# EAGLE design NSA_Control_FinalPTH3 (EAGLE 6.1)
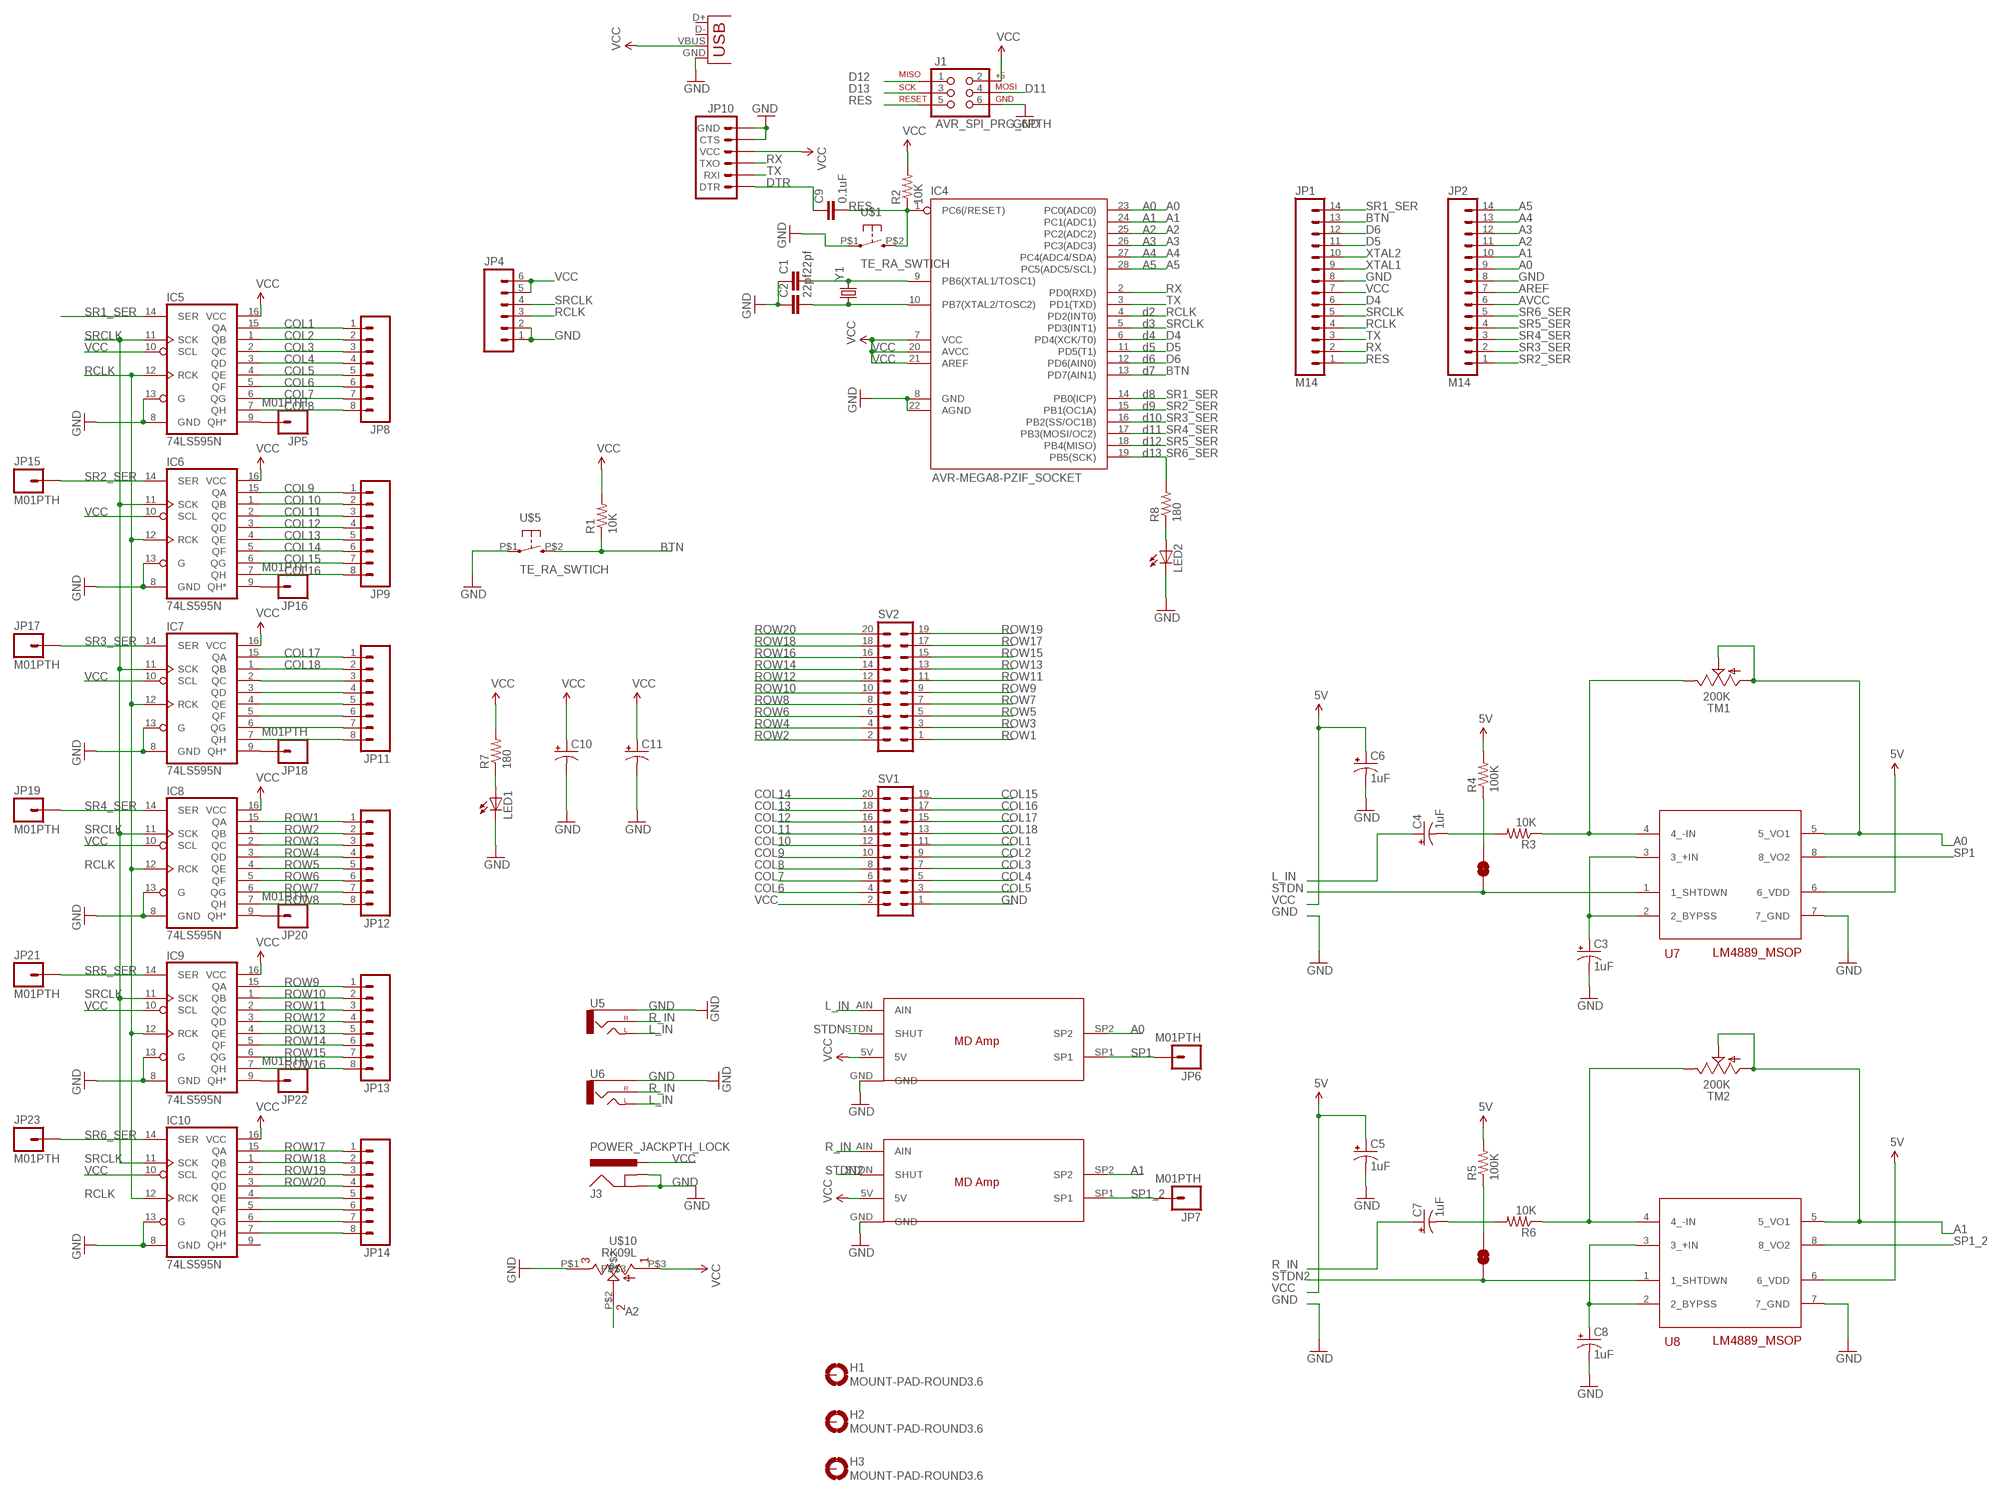
[diagram p0: schematic, sheet 1]

## Parts
C1  22pf  CAPPTH  [CAP-PTH-SMALL]
C2  22pf  CAPPTH  [CAP-PTH-SMALL]
C3  1uF  CAP_POL1206-KIT  [EIA3216-KIT]
C4  1uF  CAP_POL1206-KIT  [EIA3216-KIT]
C5  1uF  CAP_POL1206-KIT  [EIA3216-KIT]
C6  1uF  CAP_POL1206-KIT  [EIA3216-KIT]
C7  1uF  CAP_POL1206-KIT  [EIA3216-KIT]
C8  1uF  CAP_POL1206-KIT  [EIA3216-KIT]
C9  0.1uF  CAPPTH  [CAP-PTH-SMALL]
C10  CPOL-USE5-8.5  [E5-8,5]
C11  CPOL-USE5-8.5  [E5-8,5]
H1  MOUNT-PAD-ROUND3.6  [3,6-PAD]
H2  MOUNT-PAD-ROUND3.6  [3,6-PAD]
H3  MOUNT-PAD-ROUND3.6  [3,6-PAD]
IC4  AVR-MEGA8-PZIF_SOCKET  [DIL28-3-ZIF_SOCKET]
IC5  74LS595N  [DIL16]
IC6  74LS595N  [DIL16]
IC7  74LS595N  [DIL16]
IC8  74LS595N  [DIL16]
IC9  74LS595N  [DIL16]
IC10  74LS595N  [DIL16]
J1  AVR_SPI_PRG_6PTH  [2X3]
J3  POWER_JACKPTH_LOCK  [POWER_JACK_PTH_LOCK]
JP1  M14  [1X14]
JP2  M14  [1X14]
JP4  M06LONGPADS  [1X06_LONGPADS]
JP5  M01PTH  [1X01]
JP6  M01PTH  [1X01]
JP7  M01PTH  [1X01]
JP8  M08LONGPADS  [1X08_LONGPADS]
JP9  M08LONGPADS  [1X08_LONGPADS]
JP10  ARDUINO_SERIAL_PROGRAMLOCK  [1X06_LOCK]
JP11  M08LONGPADS  [1X08_LONGPADS]
JP12  M08LONGPADS  [1X08_LONGPADS]
JP13  M08LONGPADS  [1X08_LONGPADS]
JP14  M08LONGPADS  [1X08_LONGPADS]
JP15  M01PTH  [1X01]
JP16  M01PTH  [1X01]
JP17  M01PTH  [1X01]
JP18  M01PTH  [1X01]
JP19  M01PTH  [1X01]
JP20  M01PTH  [1X01]
JP21  M01PTH  [1X01]
JP22  M01PTH  [1X01]
JP23  M01PTH  [1X01]
LED1  LED5MM  [LED5MM]
LED2  LED5MM  [LED5MM]
R1  10K  RESISTORPTH-1/4W  [AXIAL-0.4]
R2  10K  RESISTORPTH-1/4W  [AXIAL-0.4]
R3  10K  RESISTOR1206  [1206]
R4  100K  RESISTOR1206  [1206]
R5  100K  RESISTOR1206  [1206]
R6  10K  RESISTOR1206  [1206]
R7  180  RESISTORPTH-1/4W  [AXIAL-0.4]
R8  180  RESISTORPTH-1/4W  [AXIAL-0.4]
SJ1  SOLDERJUMPERNC  [SJ_2S]
SJ2  SOLDERJUMPERNC  [SJ_2S]
SV1  ML20  [ML20]
SV2  ML20  [ML20]
TM1  200K  TRIM  [6MM]
TM2  200K  TRIM  [6MM]
U5  AUDIO-JACKPTH  [AUDIO-JACK]
U6  AUDIO-JACKPTH  [AUDIO-JACK]
U7  LM4889_MSOP  [MSOP8]
U8  LM4889_MSOP  [MSOP8]
U$1  TE_RA_SWTICH  [TE_RA_SWITCH]
U$5  TE_RA_SWTICH  [TE_RA_SWITCH]
U$6  MD_AMP  [MD_AMP]
U$7  MD_AMP  [MD_AMP]
U$10  RK09L  [RK09L]
X1  USBSMD  [USB-MINIB]
Y1  CRYSTALHC49UV  [HC49U-V]

## Nets
6V: R4.2 R5.2 U7.6(6_VDD) U8.6(6_VDD) ; supply symbol labelled 5V
A0: IC4.23(PC0(ADC0)) JP2.9 TM1.A TM1.S U7.5(5_VO1) U$6.SP2
A1: IC4.24(PC1(ADC1)) JP2.10 TM2.A TM2.S U8.5(5_VO1) U$7.SP2
A2: IC4.25(PC2(ADC2)) JP2.11 U$10.P$2
A3: IC4.26(PC3(ADC3)) JP2.12
A4: IC4.27(PC4(ADC4/SDA)) JP2.13
A5: IC4.28(PC5(ADC5/SCL)) JP2.14
AREF: JP2.7
AVCC: JP2.6
BTN: IC4.13(PD7(AIN1)) JP1.13 R1.P$1 U$5.P$2
COL1: IC5.15(QA) JP8.1 SV1.11
COL2: IC5.1(QB) JP8.2 SV1.9
COL3: IC5.2(QC) JP8.3 SV1.7
COL4: IC5.3(QD) JP8.4 SV1.5
COL5: IC5.4(QE) JP8.5 SV1.3
COL6: IC5.5(QF) JP8.6 SV1.4
COL7: IC5.6(QG) JP8.7 SV1.6
COL8: IC5.7(QH) JP8.8 SV1.8
COL9: IC6.15(QA) JP9.1 SV1.10
COL10: IC6.1(QB) JP9.2 SV1.12
COL11: IC6.2(QC) JP9.3 SV1.14
COL12: IC6.3(QD) JP9.4 SV1.16
COL13: IC6.4(QE) JP9.5 SV1.18
COL14: IC6.5(QF) JP9.6 SV1.20
COL15: IC6.6(QG) JP9.7 SV1.19
COL16: IC6.7(QH) JP9.8 SV1.17
COL17: IC7.15(QA) JP11.1 SV1.15
COL18: IC7.1(QB) JP11.2 SV1.13
D4: IC4.6(PD4(XCK/T0)) JP1.6
D5: IC4.11(PD5(T1)) JP1.11
D6: IC4.12(PD6(AIN0)) JP1.12
D11: J1.4
D12: J1.1
D13: J1.3
DTR: C9.1 JP10.1(DTR)
GND: C1.1 C2.1 C3.C(-) C5.C(-) C6.C(-) C8.C(-) C10.- C11.- IC4.8(GND) IC4.22(AGND) IC5.8(GND) IC5.13(G) IC6.8(GND) IC6.13(G) IC7.8(GND) IC7.13(G) IC8.8(GND) IC8.13(G) IC9.8(GND) IC9.13(G) IC10.8(GND) IC10.13(G) J1.6 J3.GND J3.GNDBREAK JP1.8 JP2.8 JP4.1 JP4.2 JP10.5(CTS) JP10.6(GND) LED1.K(C) LED2.K(C) SV1.1 U5.SLEEVE U6.SLEEVE U7.7(7_GND) U8.7(7_GND) U$1.P$1 U$5.P$1 U$6.GND U$7.GND U$10.P$1 X1.GND
L_IN: C4.A(+) U5.TIP(LEFT) U6.TIP(LEFT) U$6.AIN
N$1: IC7.4(QE) JP11.5
N$2: IC7.5(QF) JP11.6
N$3: IC7.6(QG) JP11.7
N$4: IC7.7(QH) JP11.8
N$5: IC10.4(QE) JP14.5
N$6: IC10.5(QF) JP14.6
N$7: LED1.A R7.P$1
N$8: LED2.A R8.P$1
N$9: IC10.6(QG) JP14.7
N$10: C8.A(+) U8.2(2_BYPSS) U8.3(3_+IN)
N$11: IC5.9(QH*) JP5.1
N$12: IC6.9(QH*) JP16.1
N$13: IC10.7(QH) JP14.8
N$14: C3.A(+) U7.2(2_BYPSS) U7.3(3_+IN)
N$15: R6.1 TM2.E U8.4(4_-IN)
N$16: R3.1 TM1.E U7.4(4_-IN)
N$17: C4.C(-) R3.2
N$18: C7.C(-) R6.2
N$19: R4.1 SJ1.2
N$20: R5.1 SJ2.2
N$21: IC7.2(QC) JP11.3
N$22: IC7.3(QD) JP11.4
N$23: IC7.9(QH*) JP18.1
N$24: IC8.9(QH*) JP20.1
N$25: IC9.9(QH*) JP22.1
R_IN: C7.A(+) U5.RING(RIGHT) U6.RING(RIGHT) U$7.AIN
RCLK: IC4.4(PD2(INT0)) IC5.12(RCK) IC6.12(RCK) IC7.12(RCK) IC8.12(RCK) IC9.12(RCK) IC10.12(RCK) JP1.4 JP4.3
RES: C9.2 IC4.1(PC6(/RESET)) J1.5 JP1.1 R2.P$1 U$1.P$2
ROW1: IC8.15(QA) JP12.1 SV2.1
ROW2: IC8.1(QB) JP12.2 SV2.2
ROW3: IC8.2(QC) JP12.3 SV2.3
ROW4: IC8.3(QD) JP12.4 SV2.4
ROW5: IC8.4(QE) JP12.5 SV2.5
ROW6: IC8.5(QF) JP12.6 SV2.6
ROW7: IC8.6(QG) JP12.7 SV2.7
ROW8: IC8.7(QH) JP12.8 SV2.8
ROW9: IC9.15(QA) JP13.1 SV2.9
ROW10: IC9.1(QB) JP13.2 SV2.10
ROW11: IC9.2(QC) JP13.3 SV2.11
ROW12: IC9.3(QD) JP13.4 SV2.12
ROW13: IC9.4(QE) JP13.5 SV2.13
ROW14: IC9.5(QF) JP13.6 SV2.14
ROW15: IC9.6(QG) JP13.7 SV2.15
ROW16: IC9.7(QH) JP13.8 SV2.16
ROW17: IC10.15(QA) JP14.1 SV2.17
ROW18: IC10.1(QB) JP14.2 SV2.18
ROW19: IC10.2(QC) JP14.3 SV2.19
ROW20: IC10.3(QD) JP14.4 SV2.20
RX: IC4.2(PD0(RXD)) JP1.2 JP10.3(TXO)
SP1: JP6.1 U7.8(8_VO2) U$6.SP1
SP1_2: JP7.1 U8.8(8_VO2) U$7.SP1
SR1_SER: IC4.14(PB0(ICP)) IC5.14(SER) JP1.14
SR2_SER: IC4.15(PB1(OC1A)) IC6.14(SER) JP2.1 JP15.1
SR3_SER: IC4.16(PB2(SS/OC1B)) IC7.14(SER) JP2.2 JP17.1
SR4_SER: IC4.17(PB3(MOSI/OC2)) IC8.14(SER) JP2.3 JP19.1
SR5_SER: IC4.18(PB4(MISO)) IC9.14(SER) JP2.4 JP21.1
SR6_SER: IC4.19(PB5(SCK)) IC10.14(SER) JP2.5 JP23.1 R8.P$2
SRCLK: IC4.5(PD3(INT1)) IC5.11(SCK) IC6.11(SCK) IC7.11(SCK) IC8.11(SCK) IC9.11(SCK) IC10.11(SCK) JP1.5 JP4.4
STDN: SJ1.1 U7.1(1_SHTDWN) U$6.STDN(SHUT)
STDN2: SJ2.1 U8.1(1_SHTDWN) U$7.STDN(SHUT)
TX: IC4.3(PD1(TXD)) JP1.3 JP10.2(RXI)
VCC: C5.A(+) C6.A(+) C10.+ C11.+ IC4.7(VCC) IC4.20(AVCC) IC4.21(AREF) IC5.10(SCL) IC5.16(VCC) IC6.10(SCL) IC6.16(VCC) IC7.10(SCL) IC7.16(VCC) IC8.10(SCL) IC8.16(VCC) IC9.10(SCL) IC9.16(VCC) IC10.10(SCL) IC10.16(VCC) J1.2 J3.PWR JP1.7 JP4.5 JP4.6 JP10.4(VCC) R1.P$2 R2.P$2 R7.P$2 SV1.2 U$6.5V U$7.5V U$10.P$3 X1.VBUS ; supply symbol labelled 5V
XTAL1: C1.2 IC4.9(PB6(XTAL1/TOSC1)) JP1.9 Y1.2
XTAL2: C2.2 IC4.10(PB7(XTAL2/TOSC2)) JP1.10 Y1.1
Unconnected: H1.B3,6(MOUNT) H2.B3,6(MOUNT) H3.B3,6(MOUNT) IC10.9(QH*) X1.D+ X1.D-

## Notes on the sheet
- A0
- A1
- A2
- A3
- A4
- A5
- d2
- d3
- d4
- d5
- d6
- d7
- d8
- d9
- d10
- d11
- d12
- d13

## Library data of the parts
C1 C2 C9 = sparkFun:CAP: Capacitor Standard 0603 ceramic capacitor, and 0.1" leaded capacitor.
C3-C8 = sparkFun:CAP_POL: Capacitor Polarized These are standard SMD and PTH capacitors. Normally 10uF, 47uF, and 100uF in electrolytic and tantalum varieties. Always verify the external diameter of the through hole cap, it varies with capacity, voltage, and manufacturer. The EIA devices should be standard.
C10 C11 = adafruit:CPOL-US: POLARIZED CAPACITOR, American symbol
H1-H3 = holes:MOUNT-PAD-ROUND: MOUNTING PAD, round
IC4 = sparkFun:AVR-MEGA8-P: MICROCONTROLLER 8 Kbytes FLASH 1 kbytes SRAM 512 bytes EEPROM USART 4-channel 10 bit ADC 2-channel 8 bit ADC
IC5-IC10 = sparkFun:74*595: 8-bit SHIFT REGISTER, output latch
J1 = sparkFun:AVR_SPI_PRG_6: AVR ISP 6 Pin This is the reduced ISP connector for AVR programming. Common on Arduino. This footprint will take up less PCB space and can be used with a 10-pin to 6-pin adapter such as SKU: BOB-08508
J3 = sparkFun:POWER_JACK: Power Jack This is the standard 5.5mm barrel jack for power. The PTH is the most common, proven, reliable, footprint. All others are experimental. The Slot footprint only works if the mill layer is transmitted to the PCB fab house so be warned. Spark Fun Electronics SKU : PRT-00119. Mating wall wart : TOL-00298 (and others)
JP1 JP2 = sparkFun:M14: Header 14 Standard 14-pin 0.1" header. Use with straight break away headers (SKU : PRT-00116), right angle break away headers (PRT-00553), swiss pins (PRT-00743), machine pins (PRT-00117), and female headers (PRT-00115).
JP4 = sparkFun:M06: Header 6 Standard 6-pin 0.1" header. Use with straight break away headers (SKU : PRT-00116), right angle break away headers (PRT-00553), swiss pins (PRT-00743), machine pins (PRT-00117), and female headers (PRT-00115). Molex polarized connector foot print use with SKU : PRT-08094 with associated crimp pins and housings. NOTES ON THE VARIANTS LOCK and LOCK_LONGPADS... This footprint was designed to help hold the alignment of a through-hole component (i.e. 6-pin header) while soldering it into place. You may notice that each hole has been shifted either up or down by 0.005 of an inch from it's more standard position (which is a perfectly straight line). This slight alteration caused the pins (the squares in the middle) to touch the edges of the holes. Because they are alternating, it causes a "brace" to hold the component in place. 0.005 has proven to be the perfect amount of "off-center" position when using our standard breakaway headers. Although looks a little odd when you look at the bare footprint, once you have a header in there, the alteration is very hard to notice. Also, if you push a header all the way into place, it is covered up entirely on the bottom side. This idea of altering the position of holes to aid alignment will be further integrated into the Sparkfun Library for other footprints. It can help hold any component with 3 or more connection pins.
JP5-JP7 JP15-JP23 = sparkFun:M01: Header 1 Standard 1-pin 0.1" header. Use with straight break away headers (SKU : PRT-00116), right angle break away headers (PRT-00553), swiss pins (PRT-00743), machine pins (PRT-00117), and female headers (PRT-00115).
JP8 JP9 JP11-JP14 = sparkFun:M08: Header 8 Standard 8-pin 0.1" header. Use with straight break away headers (SKU : PRT-00116), right angle break away headers (PRT-00553), swiss pins (PRT-00743), machine pins (PRT-00117), and female headers (PRT-00115).
JP10 = sparkFun:ARDUINO_SERIAL_PROGRAM
LED1 LED2 = sparkFun:LED: LEDs Standard schematic elements and footprints for 5mm, 3mm, 1206, and 0603 sized LEDs. 5mm - Spark Fun Electronics SKU : COM-00529 (and others)
R1-R8 = sparkFun:RESISTOR: Resistor Basic schematic elements and footprints for 0603, 1206, and PTH resistors.
SJ1 SJ2 = ModernDevice:SOLDERJUMPER: Solder Jumper Standard SMD solder jumper. Used to automate production. Two varients : Normally Open and Normally Closed are the same, but have different paste layers. NC will have a large amount of paste and should jumper during reflow.
SV1 SV2 = con-harting-ml:ML20: HARTING; OC_FARNELL: unknown; OC_NEWARK: unknown
TM1 TM2 = adafruit:TRIM
U5 U6 = sparkFun:AUDIO-JACK: 3.5mm Audio Jack Simple 3.5mm common PCB mount audio jack. SKU: PRT-08032
U7 U8 = ModernDevice:LM4889: LM4889 1 W Audio Amp
U$1 U$5 = 001_BoltCustom:TE_RA_SWTICH
U$6 U$7 = 001_BoltCustom:MD_AMP
U$10 = 001_BoltCustom:RK09L
X1 = sparkFun:USB: USB Connectors USB-B-PTH is fully proven SKU : PRT-00139 USB-miniB is fully proven SKU : PRT-00587 USB-A-PCB is untested. USB-A-H is throughly reviewed, but untested. Spark Fun Electronics SKU : PRT-00437 USB-B-SMT is throughly reviewed, but untested. Needs silkscreen touching up. USB-A-S has not been used/tested USB-MB-H has not been used/tested
Y1 = sparkFun:CRYSTAL: Crystals Various standard crystals. Proven footprints. Spark Fun Electronics SKU : COM-00534

## Board
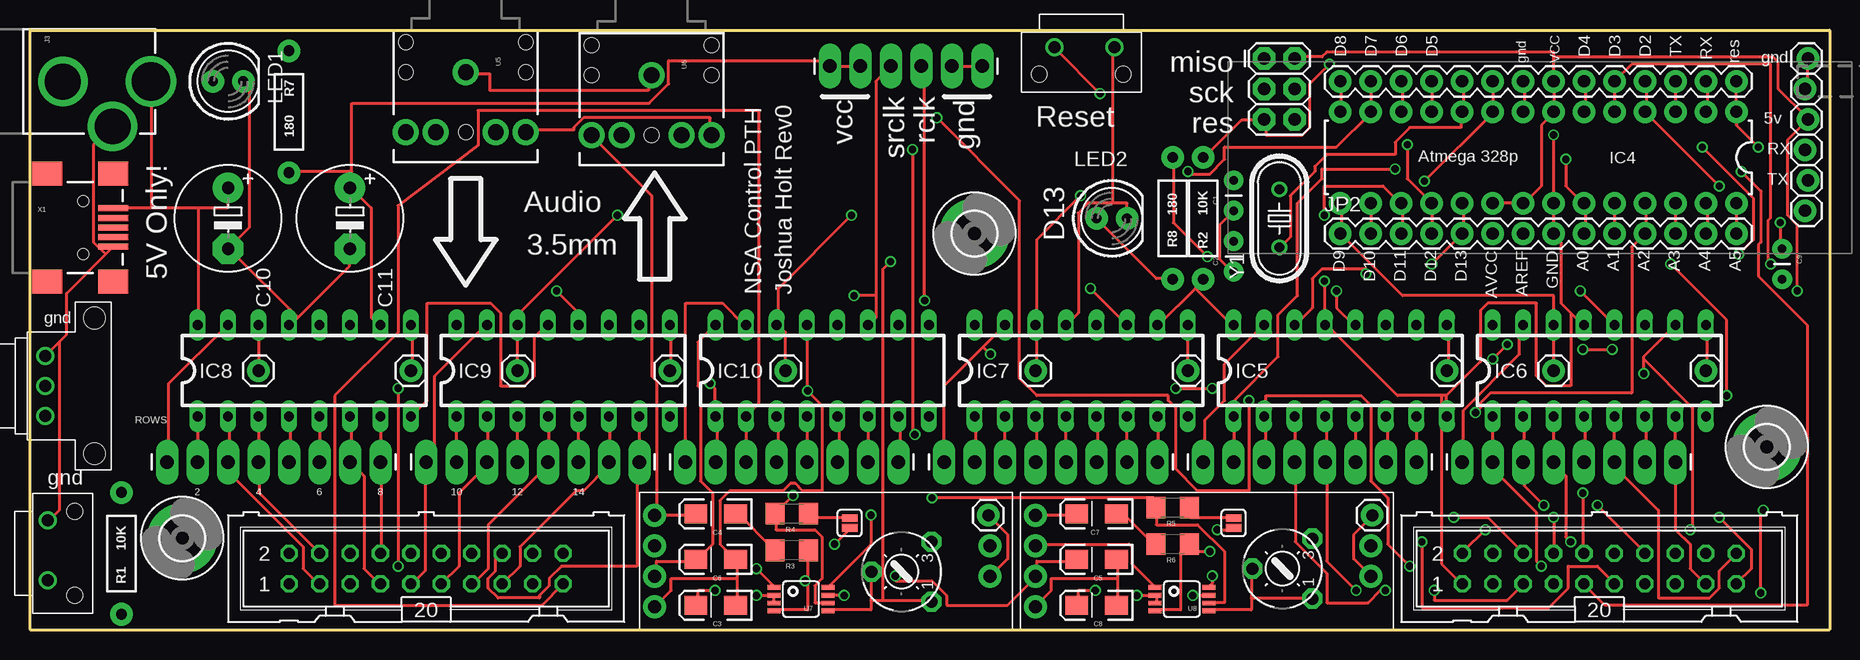
[diagram p1: board, top side]
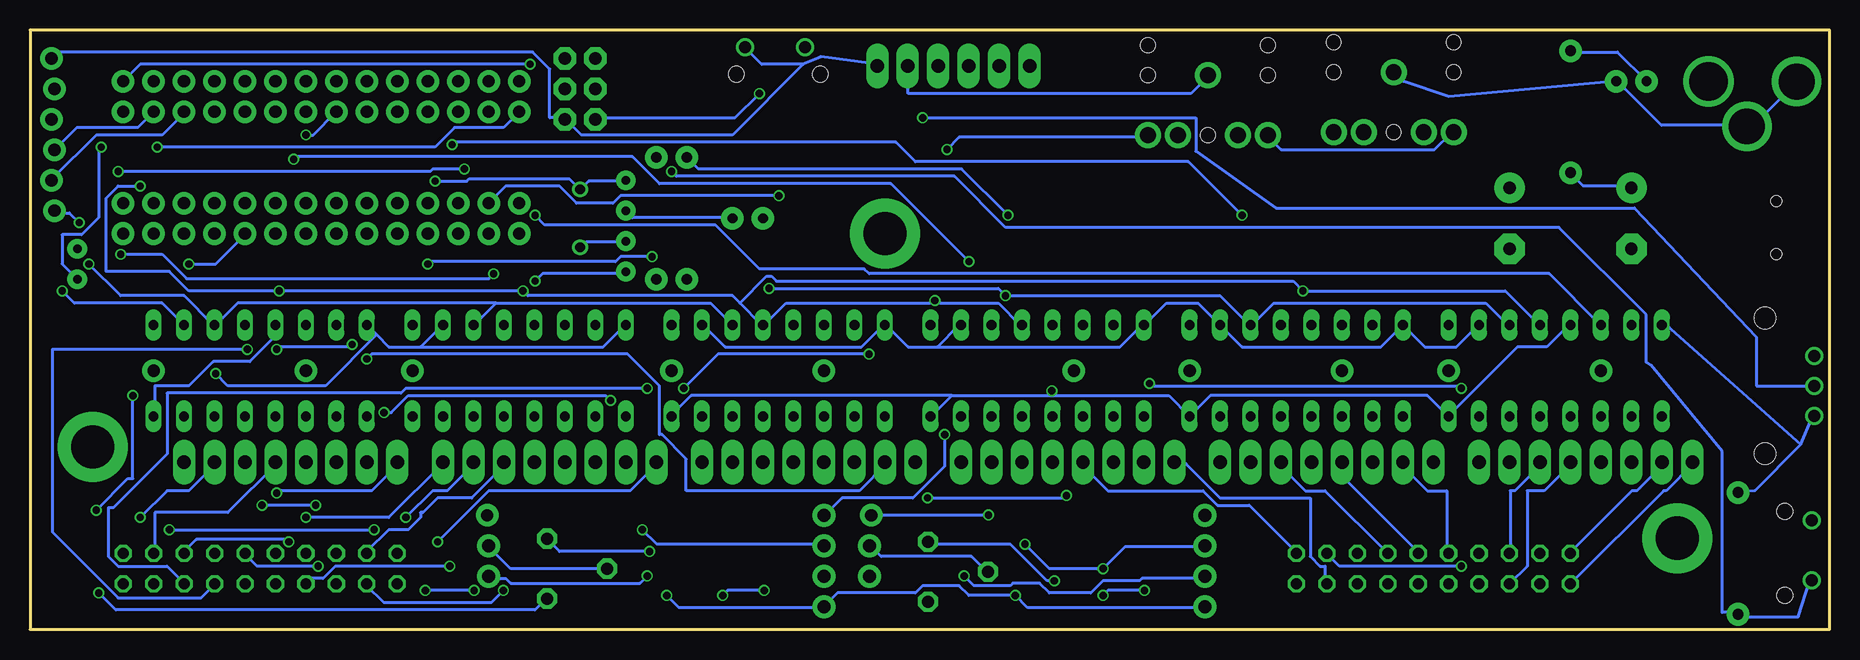
[diagram p2: board, bottom side, seen from below]

Size 150 x 50 mm. Coordinates in mm from the lower left corner, seen from the top.
Outline: 0,0 150,0 150,50 0,50 0,0
Copper layers (1*16): Top 0.035mm / dielectric 1.5mm / Bottom 0.035mm
Design rules "default": minimum track width 6mil, minimum drill 12mil, track to track 6mil, track to pad 6mil, pad to pad 6mil, via to via 6mil, smd to smd 0mil, copper to edge 10mil, drill to drill 10mil, minimum pad ring 10mil, minimum via ring 6mil, stop-mask expansion 2mil, vias tented up to drill 100mil, thermal gap 10mil

### Footprints (pad centres in the part's own frame; a part is rotated, then mirrored left to right if it is on the bottom)
CAP-PTH-SMALL = drill 0.7 pad 1.651: 1 0,0; 2 2.54,0
EIA3216-KIT = smd 1.9 x 1.6: A 1.65,0; C -1.65,0
E5-8,5 = drill 1.016 pad 2.54: + -2.54,0 | drill 1.016 pad 2.54 octagon: - 2.54,0
3,6-PAD = drill 3.6 pad 5.842: B3,6 0,0
DIL28-3-ZIF_SOCKET = drill 1.016 pad 1.88: 1 -16.51,-3.81; 2 -13.97,-3.81; 3 -11.43,-3.81; 4 -8.89,-3.81; 5 -6.35,-3.81; 6 -3.81,-3.81; 7 -1.27,-3.81; 8 1.27,-3.81; 9 3.81,-3.81; 10 6.35,-3.81; 11 8.89,-3.81; 12 11.43,-3.81; 13 13.97,-3.81; 14 16.51,-3.81; 15 16.51,3.81; 16 13.97,3.81; 17 11.43,3.81; 18 8.89,3.81; 19 6.35,3.81; 20 3.81,3.81; 21 1.27,3.81; 22 -1.27,3.81; 23 -3.81,3.81; 24 -6.35,3.81; 25 -8.89,3.81; 26 -11.43,3.81; 27 -13.97,3.81; 28 -16.51,3.81
DIL16 = drill 0.813 long: 1 -8.89,-3.81; 2 -6.35,-3.81; 3 -3.81,-3.81; 4 -1.27,-3.81; 5 1.27,-3.81; 6 3.81,-3.81; 7 6.35,-3.81; 8 8.89,-3.81; 9 8.89,3.81; 10 6.35,3.81; 11 3.81,3.81; 12 1.27,3.81; 13 -1.27,3.81; 14 -3.81,3.81; 15 -6.35,3.81; 16 -8.89,3.81
2X3 = drill 1.016 pad 1.88 octagon: 1 0,0; 2 0,2.54; 3 2.54,0; 4 2.54,2.54; 5 5.08,0; 6 5.08,2.54
POWER_JACK_PTH_LOCK = drill 2.997 pad 4.115: GND 0.025,6.557; GNDBREAK 3.762,10.7 | drill 3.2 pad 4.115: PWR 0,13.878
1X14 = drill 1.016 pad 1.88: 1 0,0; 2 2.54,0; 3 5.08,0; 4 7.62,0; 5 10.16,0; 6 12.7,0; 7 15.24,0; 8 17.78,0; 9 20.32,0; 10 22.86,0; 11 25.4,0; 12 27.94,0; 13 30.48,0; 14 33.02,0
1X06_LONGPADS = drill 1.118 pad 1.88 long: 1 0,0; 2 2.54,0; 3 5.08,0; 4 7.62,0; 5 10.16,0; 6 12.7,0
1X01 = drill 1.016 pad 1.88: 1 0,0
1X08_LONGPADS = drill 1.118 pad 1.88 long: 1 0,0; 2 2.54,0; 3 5.08,0; 4 7.62,0; 5 10.16,0; 6 12.7,0; 7 15.24,0; 8 17.78,0
1X06_LOCK = drill 1.016 pad 1.88: 1 0,0; 2 2.54,-0.254; 3 5.08,0; 4 7.62,-0.254; 5 10.16,0; 6 12.7,-0.254
LED5MM = drill 0.813 pad 1.88: A -1.27,0; K 1.27,0
AXIAL-0.4 = drill 0.9 pad 1.88: P$1 -5.08,0; P$2 5.08,0
1206 = smd 1.6 x 1.8: 1 -1.4,0; 2 1.4,0
SJ_2S = smd 0.635 x 1.27: 1 -0.412,0; 2 0.412,0
ML20 = drill 0.914 octagon: 1 -11.43,-1.27; 2 -11.43,1.27; 3 -8.89,-1.27; 4 -8.89,1.27; 5 -6.35,-1.27; 6 -6.35,1.27; 7 -3.81,-1.27; 8 -3.81,1.27; 9 -1.27,-1.27; 10 -1.27,1.27; 11 1.27,-1.27; 12 1.27,1.27; 13 3.81,-1.27; 14 3.81,1.27; 15 6.35,-1.27; 16 6.35,1.27; 17 8.89,-1.27; 18 8.89,1.27; 19 11.43,-1.27; 20 11.43,1.27
6MM = drill 1 pad 1.676 octagon: A -2.5,-2.5; E 2.5,-2.5; S 0,2.5
AUDIO-JACK = drill 1.3 pad 2.184: RING 5,5; RSH 5,2.5; SLEEVE 0,0; TIP 5,-5; TSH 5,-2.5 | hole 1.2: 0,5; -2.5,5; -2.5,-5; 0,-5; 5,0
MSOP8 = smd 0.4 x 1.1: 1 -0.975,-2.25; 2 -0.325,-2.25; 3 0.325,-2.25; 4 0.975,-2.25; 5 0.975,2.25; 6 0.325,2.25; 7 -0.325,2.25; 8 -0.975,2.25
TE_RA_SWITCH = drill 1: P$1 -2.75,2.75; P$2 2.25,2.75 | hole 1.3: -3.5,5; 3.5,5
MD_AMP = drill 1.1 pad 1.93: 5V 1.27,4.445; AIN 1.27,9.525; GND 1.27,1.905; SP1 29.21,4.445; SP2 29.21,6.985; STDN 1.27,6.985
RK09L = drill 1: P$1 -2.5,0; P$2 0,0; P$3 2.5,0 | hole 1.8: -5.65,4.1; 5.65,4.1
USB-MINIB = smd 2.5 x 0.5: D+ 2.5,0; D- 2.5,0.8; GND 2.5,-1.6; ID 2.5,-0.8; VBUS 2.5,1.6 | smd 2.5 x 2: MTN1 -3,4.5; MTN2 2.5,4.5; MTN3 -3,-4.5; MTN4 2.5,-4.5 | hole 0.9: 0,2.2; 0,-2.2
HC49U-V = drill 0.813: 1 -2.413,0; 2 2.413,0

### Placement (x,y rotation side)
C1  100.33,34.92 90 top
C2  100.33,29.84 90 top
C3  57.15,2.03 180 top
C4  57.15,9.65 180 top
C5  88.9,5.84 180 top
C6  57.15,5.84 180 top
C7  88.9,9.65 180 top
C8  88.9,2.03 180 top
C9  146.05,31.75 270 top
C10  16.51,34.29 270 top
C11  26.67,34.29 270 top
H1  12.7,7.62 0 top
H2  144.78,15.24 0 top
H3  78.74,33.02 0 top
IC4  125.73,39.37 180 top
IC5  109.22,21.59 0 top
IC6  130.81,21.59 0 top
IC7  87.63,21.59 0 top
IC8  22.86,21.59 0 top
IC9  44.45,21.59 0 top
IC10  66.04,21.59 0 top
J1  102.87,47.62 270 top
J3  -3.81,45.72 270 top
JP1  142.24,45.72 180 top
JP2  109.22,33.02 0 top
JP4  79.38,46.99 180 top
JP5  118.11,21.59 0 top
JP6  79.88,9.53 270 top
JP7  111.89,9.53 270 top
JP8  97.79,13.97 0 top
JP9  119.38,13.97 0 top
JP10  147.96,34.92 90 top
JP11  76.2,13.97 0 top
JP12  11.43,13.97 0 top
JP13  33.02,13.97 0 top
JP14  54.61,13.97 0 top
JP15  127,21.59 0 top
JP16  139.7,21.59 0 top
JP17  83.82,21.59 0 top
JP18  96.52,21.59 0 top
JP19  19.05,21.59 0 top
JP20  31.75,21.59 0 top
JP21  40.64,21.59 0 top
JP22  53.34,21.59 0 top
JP23  62.99,21.59 0 top
LED1  16.51,45.72 0 top
LED2  90.17,34.29 0 top
R1  7.62,6.35 90 top
R2  97.79,34.29 270 top
R3  63.5,6.6 180 top
R4  63.5,9.65 180 top
R5  95.25,10.16 180 top
R6  95.25,7.11 180 top
R7  21.59,43.18 270 top
R8  95.25,34.29 90 top
SJ1  68.33,8.89 90 top
SJ2  100.33,8.89 90 top
SV1  130.81,5.08 0 top
SV2  33.02,5.08 0 top
TM1  72.64,4.83 90 top
TM2  104.39,5.08 90 top
U5  36.32,46.48 270 top
U6  51.82,46.23 270 top
U7  64.26,2.54 270 top
U8  96.01,2.54 270 top
U$1  87.63,51.31 180 top
U$5  -1.27,6.35 270 top
U$6  50.8,0 0 top
U$7  82.55,0 0 top
U$10  1.27,20.32 270 top
X1  4.45,33.53 0 top
Y1  104.14,34.29 90 top

### Tracks (layer width: path | path; a pad name or v marks a point on that pad's centre or on a via)
6V  (via drill 0.61)
  Top 0.254: U7.6 66.45,2.23 65.43,2.23 65.43,3.66 66.04,4.27 66.04,7.72 65.43,8.33 62.18,8.33 62.18,9.55 R4.2 62.18,9.75 v63.6,11.18 | U8.6 98.35,2.23 99.57,2.23 99.57,6.5 97.33,8.74 93.88,8.74 93.88,10.16 R5.2 93.67,10.16 93.67,10.97 v75.18,10.97
  Bottom 0.254: v63.6,11.18 63.8,10.97 v75.18,10.97
A0  (via drill 0.61)
  Top 0.254: JP2.9 129.64,33.12 129.64,35.56 IC4.23 129.44,35.56 128.02,36.98 v128.02,39.22 | 70.1,2.44 70.1,4.67 TM1.S | 70.1,2.44 70.1,1.63 66.65,1.63 U7.5 | 70.1,2.44 71.12,2.44 | 71.12,2.44 74.98,2.44 TM1.A | v71.73,30.68 71.12,30.07 71.12,2.44
  Bottom 0.254: U$6.SP2 79.86,6.91 79.05,6.1 71.53,6.1 70.31,4.88 TM1.S | v128.02,39.22 127.81,39.42 99.77,39.42 97.54,37.19 78.23,37.19 v71.73,30.68
A1  (via drill 0.61)
  Top 0.254: IC4.24 JP2.10 | 101.8,2.64 101.8,5.08 TM2.S | 101.8,2.64 101.8,1.63 98.35,1.63 U8.5 | 101.8,2.64 106.88,2.64 TM2.A | v136.75,30.48 141.43,25.81 v141.43,19.51 | v144.47,9.96 144.27,9.75 v144.27,3.05
  Bottom 0.254: TM2.S 109.93,5.08 111.76,6.91 U$7.SP2 | v136.75,30.48 134.52,30.48 132.08,32.92 JP2.10 | v141.43,19.51 141.43,12.6 141.83,12.6 v144.47,9.96 | v144.27,3.05 142.85,1.63 107.9,1.63 107.09,2.44 TM2.A
A2  (via drill 0.61)
  Top 0.254: v75.59,42.67 82.5,35.76 82.5,20.93 83.92,19.51 94.89,19.51 94.89,19.1 95.5,18.49 95.5,13.41 97.33,11.58 101.6,11.58 v101.6,19.1 | v120.5,18.09 120.9,18.49 120.9,18.9 121.72,19.71 133.5,19.71 133.5,31.9 JP2.11 134.72,33.12 134.72,35.56 IC4.25
  Bottom 0.254: U$10.P$2 6.1,20.32 6.1,24.38 16.26,35.15 46.13,35.15 52.83,39.88 52.83,42.67 v75.59,42.67 | v101.6,19.1 102.01,19.51 118.47,19.51 119.89,18.09 v120.5,18.09
A3
  Top 0.254: IC4.26 JP2.12
A4
  Top 0.254: JP2.13 139.8,33.12 139.8,35.56 IC4.27
A5
  Top 0.254: IC4.28 JP2.14
BTN  (via drill 0.61)
  Top 0.254: JP1.13 IC4.13 111.76,43.08 108.92,40.23 99.57,40.23 99.57,39.22 98.35,38 96.52,38 v96.52,38.2
  Bottom 0.254: U$5.P$2 1.63,4.06 2.59,1.07 7.11,1.07 7.52,1.42 R1.P$1 7.72,1.42 8.94,1.42 8.94,14.83 14.88,22.05 15.29,22.3 15.29,26.26 22.55,33.53 68.68,33.53 72.95,37.8 96.11,37.8 v96.52,38.2
COL1  (via drill 0.61)
  Top 0.254: IC5.15 102.82,25.4 99.57,22.15 99.57,19.1 97.94,17.48 97.94,14.02 JP8.1 | v116.03,7.32 116.03,1.83 126.59,1.83 128.22,3.45 128.22,5.28 130.66,5.28 132.08,3.86 SV1.11
  Bottom 0.254: v116.03,7.32 111.76,11.58 99.97,11.58 97.74,13.82 JP8.1
COL2  (via drill 0.61)
  Top 0.254: JP8.2 100.38,14.02 100.38,17.68 IC5.1 100.38,17.88 100.38,19.1 104.04,22.76 104.04,26.21 105.66,27.84 105.66,35.56 107.7,37.59 107.7,38.41 v113.79,38.41 | v142.65,38.2 144.27,36.58 144.27,32.31 144.07,32.11 144.07,29.46 148.13,25.4 148.13,2.03 131.27,2.03 129.64,3.66 SV1.9
  Bottom 0.254: v142.65,38.2 116.64,38.2 116.43,38.41 v113.79,38.41
COL3  (via drill 0.61)
  Top 0.254: JP8.3 103.02,14.02 103.02,17.68 IC5.2 103.02,17.88 103.02,19.51 110.95,19.51 111.76,18.69 111.76,12.39 113.18,10.97 113.18,7.11 v115.01,5.28
  Bottom 0.254: v115.01,5.28 124.56,5.28 125.58,4.27 126.59,4.27 127,3.86 SV1.7
COL4  (via drill 0.61)
  Top 0.254: IC5.3 105.46,17.68 105.46,14.02 JP8.4 105.46,13.82 105.46,7.32 108.1,4.67 108.1,2.23 111.56,2.23 112.57,3.25 v112.98,3.25 | v117.04,3.25 117.04,2.44 123.14,2.44 124.36,3.66 SV1.5
  Bottom 0.254: v112.98,3.25 v117.04,3.25
COL5  (via drill 0.61)
  Top 0.254: IC5.4 108.1,17.68 108.1,14.02 JP8.5 108.1,13.82 108.1,5.69 v110.54,3.25
  Bottom 0.254: v110.54,3.25 111.56,2.23 120.5,2.23 121.92,3.66 SV1.3
COL6
  Top 0.254: IC5.5 110.54,17.68 110.54,14.02 JP8.6
  Bottom 0.254: SV1.4 121.92,6.5 120.09,8.33 118.47,8.33 117.45,9.35 117.45,9.75 117.25,9.75 116.03,10.97 113.18,10.97 110.34,13.82 JP8.6
COL7  (via drill 0.61)
  Top 0.254: IC5.6 113.18,17.68 113.18,14.02 JP8.7 | v118.67,9.35 121.51,9.35 124.36,6.5 SV1.6
  Bottom 0.254: v118.67,9.35 116.43,11.58 115.21,11.58 112.98,13.82 JP8.7
COL8  (via drill 0.61)
  Top 0.254: IC5.7 115.62,17.68 115.62,14.02 JP8.8 | v127,9.35 SV1.8
  Bottom 0.254: v127,9.35 120.09,9.35 115.62,13.82 JP8.8
COL9  (via drill 0.61)
  Top 0.254: IC6.15 124.36,25.4 124.16,25.2 124.16,22.96 119.48,18.29 119.48,14.02 JP9.1 | v129.44,11.38 129.44,6.5 SV1.10
  Bottom 0.254: v129.44,11.38 129.24,11.58 121.51,11.58 119.28,13.82 JP9.1
COL10  (via drill 0.61)
  Top 0.254: IC6.1 JP9.2 121.92,13.41 125.58,9.75 125.58,5.69 v125.98,5.28
  Bottom 0.254: v125.98,5.28 131.06,5.28 132.08,6.3 SV1.12
COL11  (via drill 0.61)
  Top 0.254: IC6.2 124.56,17.68 124.56,14.02 JP9.3 124.56,13.82 124.56,11.99 v126.19,10.36 | v130.66,10.36 134.52,6.5 SV1.14
  Bottom 0.254: v126.19,10.36 v130.66,10.36
COL12  (via drill 0.61)
  Top 0.254: IC6.3 JP9.4 127,13.82 128.02,12.8 128.02,7.72 v128.42,7.32
  Bottom 0.254: v128.42,7.32 128.63,7.52 136.14,7.52 137.16,6.5 SV1.16
COL13
  Top 0.254: IC6.4 129.64,17.68 129.64,14.02 JP9.5
  Bottom 0.254: SV1.18 139.6,6.5 139.6,9.75 133.5,9.75 129.44,13.82 JP9.5
COL14
  Top 0.254: IC6.5 JP9.6 132.08,13.61 135.74,9.96 135.74,2.64 140,2.64 140.82,3.45 140.82,4.88 142.24,6.3 SV1.20
COL15  (via drill 0.61)
  Top 0.254: IC6.6 134.72,17.68 134.72,14.02 JP9.7 | v140.82,9.35 143.46,6.71 143.46,5.08 142.24,3.86 SV1.19
  Bottom 0.254: v140.82,9.35 138.58,11.58 136.75,11.58 134.52,13.82 JP9.7
COL16
  Top 0.254: IC6.7 JP9.8 137.16,8.33 138.38,7.11 138.38,5.08 139.6,3.86 SV1.17
COL17  (via drill 0.61)
  Top 0.254: 79.45,23.57 76.2,20.32 JP11.1 | 79.45,23.57 IC7.15 | v95.5,20.12 v98.55,20.12 | 79.45,23.57 v80.06,22.96
  Bottom 0.254: v98.55,20.12 118.67,20.12 119.08,19.71 138.58,19.71 138.58,14.63 143.05,10.16 143.46,10.16 143.46,6.1 142.65,5.28 138.58,5.28 137.16,3.86 SV1.15 | v95.5,20.12 92.66,22.96 v80.06,22.96
COL18  (via drill 0.61)
  Top 0.254: IC7.1 78.84,17.68 78.84,14.02 JP11.2 | v129.44,23.37 v131.88,23.37 | v121.92,22.55 v123.14,23.77
  Bottom 0.254: v131.88,23.37 148.13,23.37 148.13,8.13 142.65,2.64 135.74,2.64 134.72,3.66 SV1.13 | v129.44,23.37 129.24,23.57 123.34,23.57 v123.14,23.77 | v121.92,22.55 121.51,22.96 100.18,22.96 97.54,20.32 97.54,16.26 97.33,16.26 95.3,14.22 95.3,11.58 80.87,11.58 78.64,13.82 JP11.2
D4
  Top 0.254: IC4.6 129.64,43.28 129.64,45.72 JP1.6
D5
  Top 0.254: JP1.11 IC4.11
D6
  Top 0.254: IC4.12 114.4,43.28 114.4,45.72 JP1.12
DTR  (via drill 0.61)
  Top 0.254: v145.9,33.93 145.9,31.9 C9.1
  Bottom 0.254: v145.9,33.93 146.71,34.75 147.93,34.75 JP10.1
GND  (via drill 0.61)
  Top 0.254: 118.06,19.51 117.65,19.51 | 117.65,19.51 114,19.51 108.1,25.4 IC5.13 107.9,25.4 v107.9,29.06 | 118.06,19.51 118.06,17.88 IC5.8 118.26,17.88 | 117.65,19.51 117.65,5.49 119.28,3.86 SV1.1 | IC4.8 124.56,43.28 124.56,45.72 JP1.8 | 139.8,17.88 IC6.8 | 128.42,26.42 127.61,27.23 127.61,32.31 127,32.92 JP2.8 IC4.22 v127,41.25 | 128.42,26.42 129.44,25.4 IC6.13 | 118.06,19.51 120.9,22.35 120.9,26.62 121.51,27.23 125.58,27.23 125.58,21.13 126.39,20.32 128.42,20.32 128.42,26.42 | C2.1 100.18,29.87 99.16,30.89 99.16,33.73 100.18,34.75 C1.1 | IC7.13 87.38,26.42 87.38,34.75 88.19,35.56 90.22,35.56 | 90.22,35.56 91.44,35.56 LED2.K | JP10.5 148.13,45.11 148.13,47.55 JP10.6 | JP4.2 77.01,46.94 79.25,46.94 JP4.1 | 90.22,35.56 90.22,48.36 U$1.P$1 | 90.63,4.27 90.63,5.69 C5.C | 90.63,4.27 90.63,2.03 C8.C | v96.93,2.85 98.15,2.85 U8.7 | 90.63,4.27 85.14,4.27 85.14,3.25 83.92,2.03 U$7.GND | 58.93,4.27 58.93,5.69 C6.C 58.73,5.89 57.51,7.11 57.51,10.77 58.32,11.58 62.79,11.58 63.4,12.19 63.8,12.19 64.41,11.58 66.04,11.58 66.04,18.69 v64.82,19.91 64.82,25.4 IC10.13 | 58.93,4.27 58.93,2.03 C3.C | v67.87,2.85 66.65,2.85 U7.7 | 58.93,4.27 53.44,4.27 53.44,3.25 52.22,2.03 U$6.GND | 96.52,17.88 IC7.8 | 53.44,17.88 IC9.8 | 74.98,17.88 IC10.8 | 22.35,26.01 26.62,30.28 26.62,31.7 C11.- | 22.35,26.01 21.74,25.4 IC8.13 | IC9.13 43.08,25.4 42.06,24.38 42.06,21.13 41.25,20.32 39.22,20.32 39.22,26.42 38.41,27.23 33.12,27.23 33.12,19.1 31.9,17.88 IC8.8 | 22.35,26.01 16.66,31.7 C10.- 18.29,33.53 18.29,45.31 17.88,45.72 LED1.K | 6.3,31.29 3.05,28.04 3.05,24.59 2.44,23.98 | 6.3,31.29 6.91,31.9 X1.GND | 2.44,23.98 1.42,22.96 U$10.P$1
  Top 0.254: 2.44,23.98 2.44,9.96 1.63,9.14 U$5.P$1 | U5.SLEEVE 36.37,46.33 38.35,46.33 38.35,44.96 51.56,44.96 51.56,46.48 51.82,46.33 U6.SLEEVE | 6.3,31.29 5.28,32.31 5.28,40.44 6.71,41.86 J3.GNDBREAK
  Bottom 0.254: IC6.8 139.6,17.88 139.6,20.32 136.75,20.32 134.72,22.35 131.67,22.35 129.64,24.38 129.64,25.4 IC6.13 | IC4.8 126.39,41.25 v127,41.25 | C1.1 100.18,34.75 99.77,34.34 91.44,34.34 LED2.K | 85.55,47.14 84.33,47.65 84.07,47.75 79.45,47.14 JP4.1 | 85.55,47.14 89,47.14 90.22,48.36 U$1.P$1 | 85.55,47.14 91.44,41.25 104.04,41.25 105.26,42.47 J1.6 105.46,42.67 106.68,42.67 106.68,46.74 108.1,48.16 147.73,48.16 148.13,47.75 JP10.6 | v107.9,29.06 107.29,29.67 100.38,29.67 C2.1 | v96.93,2.85 95.91,1.83 83.92,1.83 U$7.GND 83.72,2.03 82.7,3.05 76.2,3.05 75.59,3.66 72.54,3.66 71.73,2.85 v67.87,2.85 66.85,1.83 52.22,1.83 U$6.GND | 73.15,19.51 64.82,19.51 | 64.82,19.51 55.07,19.51 IC9.8 51.61,19.51 33.53,19.51 31.9,17.88 IC8.8 31.7,17.88 26.01,23.57 23.57,23.57 21.74,25.4 IC8.13 | 73.15,19.51 74.78,17.88 IC10.8 | 64.82,19.51 v64.82,19.91 | 73.15,19.51 94.89,19.51 96.52,17.88 IC7.8 | J3.GND 2.85,45.52 6.3,42.06 6.71,42.06 J3.GNDBREAK 6.91,42.06 14.02,42.06 17.68,45.72 LED1.K 31.75,44.45 35.56,45.72 U5.SLEEVE | JP4.2 76.81,46.94 76.81,44.7 53.24,44.7 51.82,46.13 U6.SLEEVE
L_IN
  Top 0.254: 52.22,9.55 55.47,9.55 C4.A | 52.22,9.55 52.22,20.73 51.82,21.13 51.82,36.17 46.94,41.05 U6.TIP | 52.22,9.55 U$6.AIN
  Bottom 0.254: U5.TIP 31.5,41.45 32.92,40.03 45.72,40.03 46.74,41.05 U6.TIP
N$1
  Top 0.254: JP11.5 IC7.4
N$2
  Top 0.254: IC7.5 89,17.68 89,14.02 JP11.6
N$3
  Top 0.254: JP11.7 IC7.6
N$4
  Top 0.254: IC7.7 94.08,17.68 94.08,14.02 JP11.8
N$5
  Top 0.254: IC10.4 64.82,17.68 64.82,14.02 JP14.5
N$6
  Top 0.254: IC10.5 67.46,17.68 67.46,14.02 JP14.6
N$7
  Bottom 0.254: LED1.A 17.68,48.16 21.54,48.16 R7.P$1
N$8
  Top 0.254: LED2.A 89,34.14 93.88,29.26 95.1,29.26 R8.P$1
N$9
  Top 0.254: IC10.6 69.9,17.68 69.9,14.02 JP14.7
N$10  (via drill 0.61)
  Top 0.254: U8.3 93.88,2.23 93.88,2.85 U8.2 93.67,2.85 v92.25,2.85 | v88.8,3.25 87.38,3.25 87.38,2.03 C8.A
  Bottom 0.254: v92.25,2.85 91.85,3.25 v88.8,3.25
N$11
  Top 0.254: IC5.9 118.26,25.4 118.26,21.74 JP5.1
N$12
  Top 0.254: IC6.9 139.8,25.4 139.8,21.74 JP16.1
N$13
  Top 0.254: IC10.7 72.54,17.68 72.54,14.02 JP14.8
N$14  (via drill 0.61)
  Top 0.254: 61.98,2.85 61.98,2.23 U7.3 | v60.55,2.85 61.98,2.85 | v57.1,3.25 55.68,3.25 55.68,2.03 C3.A | 61.98,2.85 U7.2
  Bottom 0.254: v60.55,2.85 60.15,3.25 v57.1,3.25
N$15  (via drill 0.61)
  Top 0.254: U8.4 93.88,1.63 95.91,1.63 95.91,6.5 96.52,7.11 R6.1 96.72,7.11 96.72,6.5 v98.35,6.5
  Bottom 0.254: v98.35,6.5 105.87,6.5 106.88,7.52 TM2.E
N$16  (via drill 0.61)
  Top 0.254: 64.82,4.06 64.82,6.5 R3.1 | 64.82,4.06 64.82,1.63 62.18,1.63 U7.4 | 64.82,4.06 v64.62,4.06
  Bottom 0.254: v64.62,4.06 65.23,4.06 68.28,7.11 74.78,7.11 74.98,7.32 TM1.E
N$17
  Top 0.254: R3.2 61.98,6.71 58.93,9.75 C4.C
N$18
  Top 0.254: R6.2 93.67,7.11 91.24,9.55 90.63,9.55 C7.C
N$19
  Top 0.254: SJ1.2 68.28,9.35 65.02,9.35 65.02,9.55 R4.1
N$20
  Top 0.254: SJ2.2 100.18,9.35 96.72,9.35 96.72,10.16 R5.1
N$21
  Top 0.254: JP11.3 IC7.2
N$22
  Top 0.254: IC7.3 83.92,17.68 83.92,14.02 JP11.4
N$23
  Top 0.254: JP18.1 IC7.9
N$24
  Top 0.254: IC8.9 31.9,25.4 31.9,21.74 JP20.1
N$25
  Top 0.254: IC9.9 53.44,25.4 53.44,21.74 JP22.1
R_IN  (via drill 0.61)
  Top 0.254: C7.A 87.17,9.55 83.92,9.55 U$7.AIN | U5.RING 41.45,41.66 45.31,41.66 45.31,41.86 46.13,42.67 56.69,42.67 56.69,41.25 U6.RING | v73.76,16.26 73.56,16.46 v73.56,40.03
  Bottom 0.254: v73.76,16.26 73.76,13.61 76.4,10.97 82.3,10.97 83.72,9.55 U$7.AIN | v73.56,40.03 72.54,41.05 56.9,41.05 U6.RING
RCLK  (via drill 0.61)
  Top 0.254: v43.89,28.25 45.72,26.42 IC9.12 | JP1.4 134.72,45.72 134.72,43.28 IC4.4 v140.82,36.98 | v108.92,28.25 108.92,26.82 110.34,25.4 IC5.12 | v129.24,28.25 IC6.12 | v74.57,27.43 74.57,46.74 74.37,46.94 JP4.3
  Bottom 0.254: IC8.12 24.18,25.4 27.03,28.25 v43.89,28.25 44.7,29.06 87.78,29.06 88.19,29.46 88.59,29.46 90.83,27.23 | 74.57,27.23 86.97,27.23 88.8,25.4 IC7.12 89,25.4 90.83,27.23 | 74.57,27.23 69.29,27.23 67.46,25.4 IC10.12 | 90.83,27.23 91.44,27.84 108.51,27.84 v108.92,28.25 v129.24,28.25 136.75,28.25 138.38,29.87 143.66,29.87 143.66,35.97 142.65,36.98 v140.82,36.98 | 74.57,27.23 v74.57,27.43
RES  (via drill 0.61)
  Top 0.254: v144.07,40.23 142.24,42.06 IC4.1 JP1.1 | v89.2,44.7 85.55,48.36 U$1.P$2 | R2.P$1 97.94,39.42 100.99,42.47 102.82,42.47 J1.5 103.02,42.47 103.02,41.25 106.07,41.25 106.68,41.86 106.68,45.52 v108.31,47.14
  Bottom 0.254: C9.2 147.32,30.48 147.32,32.92 145.69,32.92 144.27,34.34 144.27,40.23 v144.07,40.23 | v89.2,44.7 91.24,42.67 102.82,42.67 J1.5 | JP1.1 140.82,47.14 v108.31,47.14
ROW1
  Top 0.254: IC8.15 16.46,25.4 11.58,20.52 11.58,14.02 JP12.1
  Bottom 0.254: SV2.1 13.82,11.58 13.61,11.58 11.38,13.82 JP12.1
ROW2
  Top 0.254: IC8.1 14.02,17.68 14.02,14.02 JP12.2
  Bottom 0.254: SV2.2 21.54,6.5 16.46,11.58 16.05,11.58 13.82,13.82 JP12.2
ROW3
  Top 0.254: IC8.2 16.66,17.68 16.66,14.02 JP12.3 16.66,13.82 16.66,13.01 22.76,6.91 22.76,5.08 23.98,3.86 SV2.3
ROW4
  Top 0.254: IC8.3 19.1,17.68 19.1,14.02 JP12.4 19.1,13.82 19.1,11.38 SV2.4
ROW5
  Top 0.254: IC8.4 21.74,17.68 21.74,14.02 JP12.5
  Bottom 0.254: SV2.5 25.2,5.28 25.2,11.58 23.77,11.58 21.54,13.82 JP12.5
ROW6
  Top 0.254: IC8.5 24.18,17.68 24.18,14.02 JP12.6
  Bottom 0.254: SV2.6 26.62,6.5 26.62,11.58 26.21,11.58 23.98,13.82 JP12.6
ROW7
  Top 0.254: IC8.6 26.82,17.68 26.82,14.02 JP12.7 27.84,12.8 27.84,5.08 29.06,3.86 SV2.7
ROW8
  Top 0.254: IC8.7 29.26,17.68 29.26,14.02 JP12.8 29.26,13.82 29.26,6.5 SV2.8
ROW9
  Top 0.254: IC9.15 38,25.4 33.73,21.13 33.73,14.63 33.12,14.02 JP13.1 32.92,13.82 32.92,4.88 31.9,3.86 SV2.9
ROW10
  Top 0.254: JP13.2 IC9.1
  Bottom 0.254: JP13.2 35.56,13.61 33.53,11.58 31.9,11.58 31.9,6.5 SV2.10
ROW11
  Top 0.254: IC9.2 38.2,17.68 38.2,14.02 JP13.3 38,13.82 38,13.61 35.76,11.38 35.76,5.28 SV2.11
ROW12
  Top 0.254: JP13.4 IC9.3
  Bottom 0.254: JP13.4 40.64,12.8 34.34,6.5 SV2.12
ROW13
  Top 0.254: IC9.4 43.28,17.68 43.28,14.02 JP13.5 43.08,13.82 43.08,13.61 38.2,8.74 38.2,5.08 36.98,3.86 SV2.13
ROW14
  Top 0.254: JP13.6 IC9.5
  Bottom 0.254: SV2.14 42.06,11.58 43.69,11.58 45.72,13.61 JP13.6
ROW15
  Top 0.254: IC9.6 48.36,17.68 48.36,14.02 JP13.7 48.16,13.82 48.16,13.61 46.13,11.58 45.52,11.58 40.84,6.91 40.84,5.28 SV2.15
ROW16
  Top 0.254: IC9.7 JP13.8 50.8,13.82 50.6,13.61 50.6,5.28 44.3,5.28 43.28,4.27 43.28,3.66 42.47,2.85 42.47,2.64 39.01,2.64 38.2,3.45 38.2,4.27 38.81,4.88 38.81,5.89 39.22,6.3 SV2.16
ROW17
  Top 0.254: IC10.15 59.54,25.4 57.71,27.23 54.66,27.23 54.66,14.02 JP14.1
  Bottom 0.254: SV2.17 42.06,3.86 42.06,5.28 42.47,5.28 43.28,6.1 43.28,10.97 50.8,10.97 53.65,13.82 54.46,13.82 JP14.1
ROW18  (via drill 0.61)
  Top 0.254: JP14.2 57.3,14.02 57.3,17.68 IC10.1 57.1,17.88 57.1,20.12 v56.69,20.52 | v30.68,20.12 v30.68,5.28
  Bottom 0.254: SV2.18 40.84,5.28 v30.68,5.28 | v30.68,20.12 30.89,20.32 56.49,20.32 v56.69,20.52
ROW19
  Top 0.254: JP14.3 59.74,14.02 59.74,17.68 IC10.2 59.74,17.88 60.76,18.9 60.76,43.28 37.34,43.28 37.34,40.39 30.68,35.36 30.68,24.79 25.4,19.51 25.4,2.03 42.67,2.03 SV2.19
ROW20
  Top 0.254: IC10.3 62.38,17.68 62.38,14.02 JP14.4
  Bottom 0.254: SV2.20 44.5,6.5 48.36,10.36 51,10.36 52.22,11.58 60.15,11.58 62.38,13.82 JP14.4
RX
  Top 0.254: IC4.2 139.8,43.28 139.8,45.72 JP1.2
  Bottom 0.254: JP10.3 146.1,41.86 141.02,41.86 IC4.2
SP1  (via drill 0.61)
  Top 0.254: v70.1,9.55 70.1,7.11 66.65,3.66 U7.8 | JP6.1 81.48,7.92 81.48,5.89 80.06,4.47 U$6.SP1
  Bottom 0.254: v70.1,9.55 79.86,9.55 JP6.1
SP1_2  (via drill 0.61)
  Top 0.254: v98.55,4.47 98.55,3.86 98.35,3.66 U8.8 | JP7.1 111.76,9.35 110.34,7.92 110.34,5.89 111.76,4.47 U$7.SP1
  Bottom 0.254: v98.55,4.47 99.16,3.86 109.93,3.86 110.34,4.27 111.76,4.27 U$7.SP1
SR1_SER  (via drill 0.61)
  Top 0.254: v111.35,29.67 111.35,30.07 107.7,30.07 106.88,29.26 106.88,26.82 105.46,25.4 IC5.14 | v142.44,31.29 143.66,32.51 143.66,35.97 v139.4,40.23 | JP1.14 109.32,45.72 109.32,43.28 IC4.14
  Bottom 0.254: v111.35,29.67 111.76,29.26 136.96,29.26 138.99,31.29 v142.44,31.29 | v139.4,40.23 116.23,40.23 114.61,41.86 110.54,41.86 IC4.14
SR2_SER
  Top 0.254: IC4.15 109.32,35.56 109.32,33.12 JP2.1 114.4,27.84 127,27.84 IC6.14 JP15.1
SR3_SER  (via drill 0.61)
  Top 0.254: IC4.16 JP2.2 | 83.92,25.4 83.92,21.74 JP17.1 | v87.58,36.17 83.92,32.51 83.92,25.4 | 83.92,25.4 IC7.14
  Bottom 0.254: IC4.16 110.34,36.98 105.87,36.98 104.44,35.56 101.4,35.56 100.79,36.17 v87.58,36.17
SR4_SER  (via drill 0.61)
  Top 0.254: JP2.3 114.4,33.12 114.4,35.56 IC4.17 114.2,35.56 112.78,36.98 107.9,36.98 v107.9,34.54 | IC8.14 19.1,25.4 19.1,21.74 JP19.1
  Bottom 0.254: v107.9,34.54 107.09,33.73 92.86,33.73 89.2,30.07 80.47,30.07 80.06,29.67 23.37,29.67 19.1,25.4 IC8.14
SR5_SER  (via drill 0.61)
  Top 0.254: JP2.4 IC4.18 114.81,37.59 v114.81,40.44 | JP21.1 IC9.14 40.64,26.21 v48.97,34.54
  Bottom 0.254: v114.81,40.44 114.61,40.64 77.83,40.64 76.2,39.01 53.44,39.01 v48.97,34.54
SR6_SER  (via drill 0.61)
  Top 0.254: IC4.19 119.48,35.56 119.48,33.12 JP2.5 v116.84,30.48 | 62.38,25.4 62.99,24.79 JP23.1 | v68.48,34.54 62.38,28.45 62.38,25.4 | 62.38,25.4 IC10.14 | v98.15,31.09 95.3,33.93 95.3,39.22 R8.P$2
  Bottom 0.254: R8.P$2 94.28,38.41 72.34,38.41 v68.48,34.54 | v116.84,30.48 116.64,30.68 101.19,30.68 100.79,31.09 v98.15,31.09
SRCLK  (via drill 0.61)
  Top 0.254: 70.51,27.84 70.51,45.72 71.73,46.94 JP4.4 | 70.51,27.84 70.51,26.01 69.9,25.4 IC10.11 | 70.51,27.84 v68.68,27.84 | IC4.5 JP1.5 133.5,47.14 145.09,47.14 145.09,34.34 144.88,34.14 144.88,30.68 v145.09,30.48 | IC7.11 v88.39,28.45
  Bottom 0.254: IC8.11 26.82,25.4 28.65,27.23 46.33,27.23 48.16,25.4 IC9.11 48.36,25.4 50.8,27.84 v68.68,27.84 69.29,28.45 v88.39,28.45 | IC7.11 93.27,27.23 111.15,27.23 | 111.15,27.23 112.98,25.4 IC5.11 | 111.15,27.23 132.69,27.23 134.52,25.4 IC6.11 134.72,25.4 137.16,27.84 142.44,27.84 v145.09,30.48
STDN  (via drill 0.61)
  Top 0.254: v60.55,5.08 61.98,3.66 U7.1 | v67.06,7.11 68.28,8.33 SJ1.1
  Bottom 0.254: U$6.STDN 52.22,6.91 58.73,6.91 v60.55,5.08 65.02,5.08 v67.06,7.11
STDN2  (via drill 0.61)
  Top 0.254: U8.1 93.67,3.66 91.85,5.49 91.85,6.91 91.64,7.11 83.92,7.11 U$7.STDN | v98.96,8.33 100.18,8.33 SJ2.1
  Bottom 0.254: v98.96,8.33 97.74,7.11 83.92,7.11 U$7.STDN
TX
  Top 0.254: JP1.3 IC4.3
  Bottom 0.254: JP10.2 148.13,37.59 144.47,41.25 138.99,41.25 137.16,43.08 IC4.3
VCC  (via drill 0.61)
  Top 0.254: 14.02,35.15 16.46,35.15 16.46,36.78 C10.+ | 14.02,35.15 10.16,35.15 | 10.16,35.15 7.11,35.15 X1.VBUS | 14.02,35.15 14.02,25.4 IC8.16 | 10.16,35.15 10.16,45.72 J3.PWR | JP4.5 69.09,46.94 66.85,46.94 JP4.6 66.65,47.45 53.24,47.45 53.24,45.52 51.61,43.89 26.82,43.89 26.82,38.2 | 26.82,38.2 26.82,36.98 C11.+ 26.82,36.78 28.45,35.15 28.45,26.01 29.06,25.4 IC8.10 | 26.82,38.2 21.74,38.2 R7.P$2 | IC4.20 IC4.21 124.56,35.56 125.98,36.98 125.98,42.06 127,43.08 IC4.7 JP1.7 127,47.75 | 127,47.75 127,48.16 108.1,48.16 107.7,47.75 105.46,47.75 J1.2 | 127,47.75 145.29,47.75 145.69,47.35 145.69,45.11 148.13,42.67 JP10.4 146.51,40.84 146.51,34.54 147.32,33.73 v147.32,28.25 | C5.A 87.17,5.69 83.92,5.69 83.92,4.47 U$7.5V 83.72,4.27 81.48,2.03 76.4,2.03 76.4,2.85 75.18,4.06 72.14,4.06 v72.14,4.47 | U$6.5V 52.22,4.47 52.22,5.69 55.47,5.69 C6.A 55.68,5.89 56.9,7.11 56.9,11.38 55.88,12.39 55.88,20.12 55.68,20.32 55.68,23.98 57.1,25.4 IC10.16 57.3,25.4 | 78.84,25.4 IC7.16 | 100.38,25.4 IC5.16 100.18,25.4 97.13,28.45 | 97.13,28.45 97.74,29.06 R2.P$2 | 97.13,28.45 94.08,25.4 IC7.10 | IC6.10 134.52,22.76 134.52,22.55 | v134.52,21.34 134.52,22.55 | v121.31,8.33 119.48,6.5 SV1.2 | v138.38,8.33 138.58,8.53 138.58,18.49 134.52,22.55
  Bottom 0.254: 2.39,15.44 6.25,11.58 R1.P$2 | 2.39,15.44 1.42,17.68 U$10.P$3 | R7.P$2 21.54,38 20.52,36.98 16.66,36.98 C10.+ | 2.39,15.44 13.61,25.4 IC8.16 | IC8.10 29.26,25.4 31.09,23.57 33.73,23.57 IC9.16 37.39,23.57 48.97,23.57 IC9.10 52.63,27.23 55.27,27.23 57.1,25.4 IC10.16 57.3,25.4 59.13,23.57 74.37,23.57 | v72.14,4.47 71.32,3.66 68.28,3.66 68.07,3.86 65.84,3.86 65.02,3.05 61.57,3.05 60.55,4.06 57.51,4.06 57.3,4.27 52.22,4.27 U$6.5V | 74.37,23.57 72.54,25.4 IC10.10 | 74.37,23.57 76.81,23.57 78.64,25.4 IC7.16 78.84,25.4 80.67,23.57 92.05,23.57 93.88,25.4 IC7.10 | 117.45,23.57 115.62,25.4 IC5.10 | 117.45,23.57 120.09,23.57 121.11,24.59 | IC6.16 121.11,24.59 | v134.52,21.34 133.5,20.32 125.37,20.32 121.11,24.59 | v138.38,8.33 v121.31,8.33 | 117.45,23.57 102.21,23.57 100.38,25.4 IC5.16 | v147.32,28.25 146.3,27.23 138.99,27.23 IC6.10
XTAL1  (via drill 0.61)
  Top 0.254: JP1.9 IC4.9 121.92,43.08 v116.23,37.39
  Bottom 0.254: C1.2 100.38,37.39 103.43,37.39 104.04,36.78 Y1.2 104.24,36.78 105.05,37.59 113.39,37.59 113.59,37.39 v116.23,37.39
XTAL2
  Top 0.254: JP1.10 119.48,45.72 119.48,43.28 IC4.10 119.28,43.08 119.28,41.86 115.01,41.86 113.79,40.64 113.79,39.62 108.1,39.62 107.09,38.61 107.09,38.2 105.05,36.17 105.05,32.72 104.24,31.9 Y1.1
  Bottom 0.254: Y1.1 104.04,31.9 103.63,32.31 100.38,32.31 C2.2

### Text on the board
tPlace: miso | D8 | D7 | D6 | D5 | D4 | D3 | D2 | TX | gnd | gnd | VCC | RX | res | sck | vcc | srclk | rclk | gnd | res | Reset | 5v | RX | Atmega 328p | D13 | TX | Audio | D9 | D10 | D11 | D12 | D13 | AVCC | AREF | GND | A0 | A1 | A2 | A3 | A4 | A5 | 3.5mm | 5V Only! | NSA Control PTH | Joshua Holt Rev0 | gnd | ROWS | gnd | 2 | 4 | 6 | 8 | 10 | 12 | 14